# Altium schematic sheet 6_Current_Sensing.SchDoc: DB_ADCS Current Sensing
size A4; DrawnBy: Augusto Cezar Boldori Vassoler; Revision: V2.1; SheetNumber: 7; SheetTotal: 7
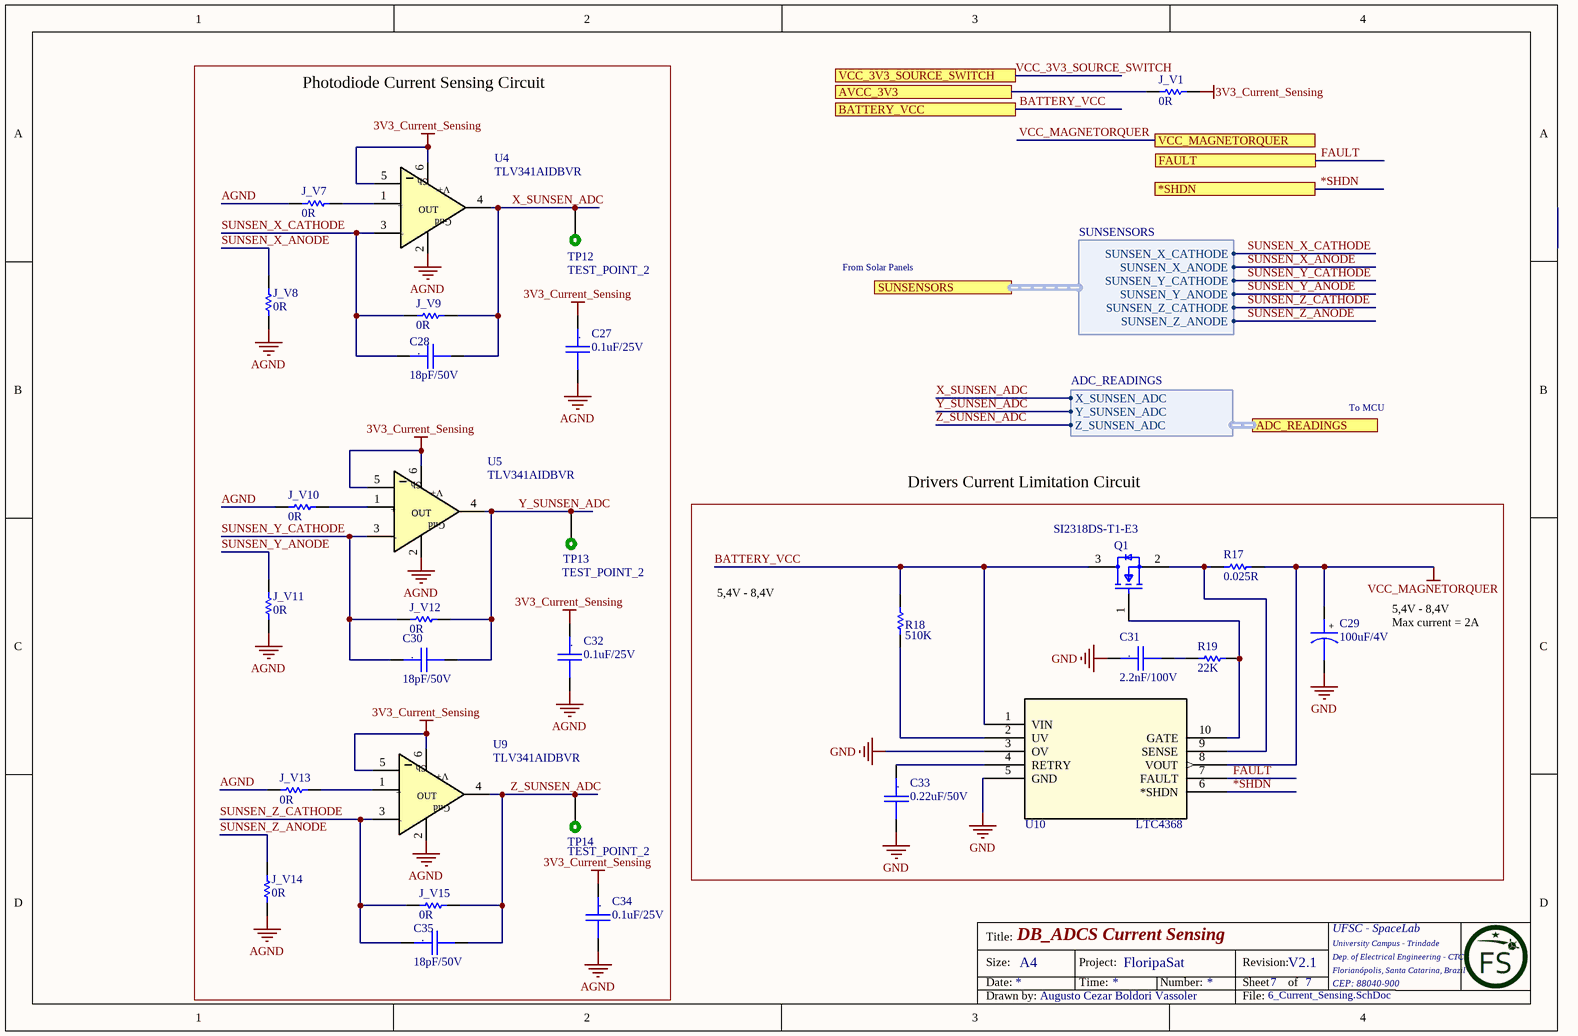
[diagram p0: 6_Current_Sensing.SchDoc]

## Parts
C27  0.1uF/25V  [CC0805]
C28  18pF/50V  [CC0805]
C29  100uF/4V  [CC0805_Tantalum]
C30  18pF/50V  [CC0805]
C31  2.2nF/100V  [CC0805]
C32  0.1uF/25V  [CC0805]
C33  0.22uF/50V  [CC0805]
C34  0.1uF/25V  [CC0805]
C35  18pF/50V  [CC0805]
J_V1  0R  [0805]
J_V7  0R  [0805-LED]
J_V8  0R  [0805-LED]
J_V9  0R  [0805-LED]
J_V10  0R  [0805-LED]
J_V11  0R  [0805-LED]
J_V12  0R  [0805-LED]
J_V13  0R  [0805-LED]
J_V14  0R  [0805-LED]
J_V15  0R  [0805-LED]
Q1  SI2318DS-T1-E3  [FP-S-03946-MFG]
R17  0.025R  [1206]
R18  510K  [0805]
R19  22K  [0805-LED]
TP12  TEST_POINT_2  [TEST_POINT_2]  (no BOM)
TP13  TEST_POINT_2  [TEST_POINT_2]  (no BOM)
TP14  TEST_POINT_2  [TEST_POINT_2]  (no BOM)
U4  TLV341AIDBVR  [SOT-23 6L]
U5  TLV341AIDBVR  [SOT-23 6L]
U9  TLV341AIDBVR  [SOT-23 6L]
U10  LTC4368  [MSOP-10_MS]

## Blocks framed on the sheet
Photodiode Current Sensing Circuit: C27 C28 C30 C32 C34 C35 J_V7-J_V15 TP12-TP14 U4 U5 U9
Drivers Current Limitation Circuit: C29 C31 C33 Q1 R17-R19 U10

## Ports
*SHDN, ADC_READINGS (harness ADC_READINGS), AVCC_3V3, BATTERY_VCC, FAULT, SUNSENSORS (harness SUNSENSORS), VCC_3V3_SOURCE_SWITCH, VCC_MAGNETORQUER

## Harnesses
ADC_READINGS: X_SUNSEN_ADC, Y_SUNSEN_ADC, Z_SUNSEN_ADC
SUNSENSORS: SUNSEN_Z_ANODE, SUNSEN_Z_CATHODE, SUNSEN_Y_ANODE, SUNSEN_Y_CATHODE, SUNSEN_X_ANODE, SUNSEN_X_CATHODE

## Nets
3V3_Current_Sensing: C27.1 C32.1 C34.1 J_V1.1 U4.5(EN) U4.6(V+) U5.5(EN) U5.6(V+) U9.5(EN) U9.6(V+)
AGND: C27.2 C32.2 C34.2 J_V7.2 J_V8.1 J_V10.2 J_V11.2 J_V13.2 J_V14.2 U4.2(Gnd) U5.2(Gnd) U9.2(Gnd)
GND: C29.2 C31.1 C33.2 U10.3(OV) U10.5(GND)
VCC_MAGNETORQUER: C29.1 R17.1 U10.8(VOUT) ; port VCC_MAGNETORQUER
*SHDN: U10.6(*SHDN) ; port *SHDN
AVCC_3V3: J_V1.2 ; port AVCC_3V3
BATTERY_VCC: Q1.3(D) R18.1 U10.1(VIN) ; port BATTERY_VCC
FAULT: U10.7(FAULT) ; port FAULT
SUNSEN_X_ANODE: J_V8.2 ; port SUNSENSORS.SUNSEN_X_ANODE
SUNSEN_X_CATHODE: C28.1 J_V9.2 U4.3(-IN) ; port SUNSENSORS.SUNSEN_X_CATHODE
SUNSEN_Y_ANODE: J_V11.1 ; port SUNSENSORS.SUNSEN_Y_ANODE
SUNSEN_Y_CATHODE: C30.1 J_V12.2 U5.3(-IN) ; port SUNSENSORS.SUNSEN_Y_CATHODE
SUNSEN_Z_ANODE: J_V14.1 ; port SUNSENSORS.SUNSEN_Z_ANODE
SUNSEN_Z_CATHODE: C35.1 J_V15.2 U9.3(-IN) ; port SUNSENSORS.SUNSEN_Z_CATHODE
VCC_3V3_SOURCE_SWITCH: port VCC_3V3_SOURCE_SWITCH
X_SUNSEN_ADC: C28.2 J_V9.1 TP12.1 U4.4(OUT) ; port ADC_READINGS.X_SUNSEN_ADC
Y_SUNSEN_ADC: C30.2 J_V12.1 TP13.1 U5.4(OUT) ; port ADC_READINGS.Y_SUNSEN_ADC
Z_SUNSEN_ADC: C35.2 J_V15.1 TP14.1 U9.4(OUT) ; port ADC_READINGS.Z_SUNSEN_ADC
NetC31_2: C31.2 R19.2
NetC33_1: C33.1 U10.4(RETRY)
NetJ_V7_1: J_V7.1 U4.1(+IN)
NetJ_V10_1: J_V10.1 U5.1(+IN)
NetJ_V13_1: J_V13.1 U9.1(+IN)
NetQ1_1: Q1.1(G) R19.1 U10.10(GATE)
NetQ1_2: Q1.2(S) R17.2 U10.9(SENSE)
NetR18_2: R18.2 U10.2(UV)

## Notes on the sheet
- From Solar Panels
- To MCU
- 5,4V - 8,4V
- 5,4V - 8,4V                                                                                                                     Max current = 2A
- Title:
- Size:
- Date:
- A4
- Project:
- Time:
- FloripaSat
- Number:
- Revision:
- Sheet
- of
- UFSC - SpaceLab
- University Campus - Trindade
- Dep. of Electrical Engineering - CTC
- Florianópolis, Santa Catarina, Brazil
- CEP: 88040-900
- Drawn by:
- File:
- (in symbol Cap_Cer_X7R_0.1uF_25V_0805) .
- (in symbol Cap_Cer_X7R_0.22uF_0805) .
- (in symbol Cap_Cer_X7R_0.0022uF_0805) .
- (in symbol Cap_Cer_X7R_18pF_50V_0805) .
- (in symbol Cap_Tant_SMD_100uF_4V_0805) +
- (in symbol TLV341AIDBVR) Sh; +; -

## Library data of the parts
C27 C32 C34 = Cap_Cer_X7R_0.1uF_25V_0805: CAP CER 0.1UF 25V 10% X7R 0805; Partnumber: CC0805KRX7R8BB104; NCM: 8532.24.10
C28 C30 C35 = Cap_Cer_X7R_18pF_50V_0805: CAP CER 18pF 50V 5% X7R 0805; Partnumber: CC0805JRNPO9BN180; NCM: 8532.24.10
C29 = Cap_Tant_SMD_100uF_4V_0805: CAP TANT 100UF 4V 20% 0805; Manufacturer: Kyocera AVX; Manufacturer Part Number: TACR107M004RTA; Dielectric Material: Tantalum; ESR (Equivalent Series Resistance): 5R; Leakage Current: 4uA; Dissipation Factor: 30%; Polarity: Polar; Supplier 1: Digi-Key; Supplier Part Number 1: 478-4755-1-ND; RoHS: Yes; Category: Tantalum Capacitors; Stock 1: 1150; Pricing 1: 1=3,32000, 10=2,68800, 100=2,05280, 500=1,56400, 1000=1,36850 (USD); Mount: Surface Mount; Case/Package: 0805; Number of Pins: 2; Case Code (Metric): 2012; Case Code (Imperial): 0805; Min Operating Temperature: -55°C; Max Operating Temperature: 125°C; Capacitance: 100uF; Tolerance: 20%; Packaging: Tape and Reel; Voltage Rating: 4V; Features: General Purpose; Voltage Rating (DC): 4V; Package Quantity: 1; Termination: SMD/SMT; Length: 2mm; Height: 1.5mm; Width: 0.053inch; Height - Seated (Max): 0.059inch; Depth: 1.35mm; ComponentLink1URL: https://datasheet.ciiva.com/265/tac-265068.pdf?src-supplier=Digi-Key; ComponentLink1Description: https://datasheet.ciiva.com/265/tac-265068.pdf?src-supplier=Digi-Key; ComponentLink2URL: https://datasheet.ciiva.com/12890/tac-12890332.pdf?src-supplier=Mouser; ComponentLink2Description: https://datasheet.ciiva.com/12890/tac-12890332.pdf?src-supplier=Mouser; ComponentLink3URL: https://datasheet.ciiva.com/265/tac-265066.pdf?src-supplier=Digi-Key; ComponentLink3Description: https://datasheet.ciiva.com/265/tac-265066.pdf?src-supplier=Digi-Key; ComponentLink4URL: https://datasheet.ciiva.com/265/tac-265067.pdf?src-supplier=Digi-Key; ComponentLink4Description: https://datasheet.ciiva.com/265/tac-265067.pdf?src-supplier=Digi-Key; ComponentLink5URL: https://datasheet.ciiva.com/11301/tac-11301084.pdf?src-supplier=Avnet; ComponentLink5Description: https://datasheet.ciiva.com/11301/tac-11301084.pdf?src-supplier=Avnet
C31 = Cap_Cer_X7R_0.0022uF_0805: Cap Cer 0.0022uF 100V X7R 5% 0805; Manufacturer: Kyocera AVX; Manufacturer Part Number: 08051C222JAT2A; Dielectric Material: Ceramic; Capacitance: 2.2nF; Dissipation Factor: 2.5%; Insulation Resistance: 100GR; Supplier 1: Digi-Key; Supplier Part Number 1: 478-3746-1-ND; RoHS: Yes; Category: Ceramic Capacitors; Stock 1: 21530; Pricing 1: 1=0,23000, 10=0,15400, 100=0,07790, 500=0,05328, 1000=0,04713 (USD); Mount: Surface Mount; Case/Package: 0805; Number of Pins: 2; Case Code (Metric): 2012; Case Code (Imperial): 0805; Contact Plating: Tin,Matte; Min Operating Temperature: -55°C; Max Operating Temperature: 125°C; Dielectric: X7R; Tolerance: 5%; Packaging: Tape and Reel; Voltage Rating (DC): 100V; Voltage Rating: 100V; Termination: SMD/SMT; Package Quantity: 1; Voltage: 100V; Length: 2.01mm; Height: 0.94mm; Depth: 1.25mm; Width: 0.049inch; Thickness: 0.037inch; Radiation Hardening: No; REACH SVHC: No SVHC; Lead Free: Lead Free; ComponentLink1URL: https://datasheet.ciiva.com/11536/cx7r-11536917.pdf?src-supplier=Avnet; ComponentLink1Description: https://datasheet.ciiva.com/11536/cx7r-11536917.pdf?src-supplier=Avnet; ComponentLink2URL: https://datasheet.ciiva.com/150/cx7r-150872.pdf?src-supplier=Digi-Key; ComponentLink2Description: https://datasheet.ciiva.com/150/cx7r-150872.pdf?src-supplier=Digi-Key; ComponentLink3URL: https://datasheet.ciiva.com/150/cx7r-150873.pdf?src-supplier=Digi-Key; ComponentLink3Description: https://datasheet.ciiva.com/150/cx7r-150873.pdf?src-supplier=Digi-Key; ComponentLink4URL: https://datasheet.ciiva.com/150/cx7r-150874.pdf?src-supplier=Digi-Key; ComponentLink4Description: https://datasheet.ciiva.com/150/cx7r-150874.pdf?src-supplier=Digi-Key; ComponentLink5URL: https://datasheet.ciiva.com/7811/cx7r-7811933.pdf?src-supplier=Element14; ComponentLink5Description: https://datasheet.ciiva.com/7811/cx7r-7811933.pdf?src-supplier=Element14; ComponentLink6URL: https://datasheet.ciiva.com/7811/cx7r-7811934.pdf?src-supplier=Element14; ComponentLink6Description: https://datasheet.ciiva.com/7811/cx7r-7811934.pdf?src-supplier=Element14; ComponentLink7URL: https://datasheet.ciiva.com/7811/cx7r-7811935.pdf?src-supplier=Element14; ComponentLink7Description: https://datasheet.ciiva.com/7811/cx7r-7811935.pdf?src-supplier=Element14
C33 = Cap_Cer_X7R_0.22uF_0805: CAP CER 0.22UF 50V X7R 0805; Manufacturer: KEMET; Manufacturer Part Number: C0805C224K5RACTU; Dielectric Material: Ceramic; Capacitance: 220nF; Tolerance: 10%; Dissipation Factor: 2.5%; Supplier 1: Digi-Key; Supplier Part Number 1: 399-3491-1-ND; RoHS: Yes; Category: Ceramic Capacitors; Stock 1: 1491563; Pricing 1: 1=0,20000, 10=0,13900, 100=0,06550, 500=0,04592, 1000=0,03802 (USD); Mount: Surface Mount,PCB; Case/Package: 0805; Case Code (Metric): 2012; Case Code (Imperial): 0805; Min Operating Temperature: -55°C; Max Operating Temperature: 125°C; Packaging: Tape and Reel; Dielectric: X7R; Package Quantity: 1; Voltage Rating: 50V; Voltage Rating (DC): 50V; Termination: SMD/SMT; Voltage: 50V; Length: 2mm; Height: 1.1mm; Depth: 1.25mm; Width: 0.049inch; Thickness: 0.055inch; Lead Pitch: 0.75mm; Radiation Hardening: No; REACH SVHC: No SVHC; ComponentLink1URL: https://datasheet.ciiva.com/7842/kem-c1002-x7r-smd-7842582.pdf?src-supplier=Element14; ComponentLink1Description: https://datasheet.ciiva.com/7842/kem-c1002-x7r-smd-7842582.pdf?src-supplier=Element14; ComponentLink2URL: https://datasheet.ciiva.com/18193/getdatasheetpartid-304413-18193686.pdf?src-supplier=Verical; ComponentLink2Description: https://datasheet.ciiva.com/18193/getdatasheetpartid-304413-18193686.pdf?src-supplier=Verical; ComponentLink3URL: https://datasheet.ciiva.com/14589/70095383-14589519.pdf?src-supplier=Allied+Electronics; ComponentLink3Description: https://datasheet.ciiva.com/14589/70095383-14589519.pdf?src-supplier=Allied+Electronics; ComponentLink4URL: https://datasheet.ciiva.com/14603/70095383-14603247.pdf?src-supplier=Allied+Electronics; ComponentLink4Description: https://datasheet.ciiva.com/14603/70095383-14603247.pdf?src-supplier=Allied+Electronics; ComponentLink5URL: https://datasheet.ciiva.com/28682/1851736-28682316.pdf?src-supplier=Element14; ComponentLink5Description: https://datasheet.ciiva.com/28682/1851736-28682316.pdf?src-supplier=Element14
J_V1 J_V7-J_V15 = R0R_JUMPER_1/16W_0805: RES 0R OHM 1/16W JUMPER 0805; Partnumber: CRCW08050000Z0EA; NCM: 8533.21.20
Q1 = CMP-02550-000015-1: MOSFET N-CH 40V 3A SOT23-3; Manufacturer: Vishay; Input Capacitace At Vds: 540pF @ 20V; Turn On Delay Time: 5ns; Standoff Height: 0.01mm; Rthja Max: 120°C/W; Power Dissipation: 0.75W; Number Of Channels: 1; Max Junction Temp: +150°C; Gate Charge At Vgs: 10nC @ 10V; Pulse Drain Current: 16A; Turn Off Delay Time: 20ns; Threshold Vgs Min: 1V; Depletion Mode: False; Max Forward Diode Voltage: 1.2V; Drain To Source Resistance: 0.036Ω; Gate To Source Voltage: 20V; Transconductance: 11S; Threshold Vgs Max: 3V; Typ Forward Diode Voltage: 0.8V; Lead Free: Yes; Temperature Range Low: -55°C; Drain To Source Voltage: 40V; Category: Trans; Number Of N Channels: 1; Temperature Range High: +150°C; RoHS: TRUE; Digikey Description: MOSFET N-CH 40V 3A SOT23-3; Mouser Description: MOSFET 40V 6A; Manufacturer Part Number: SI2318DS-T1-E3; Drain To Source Breakdown Voltage: 40V; ComponentLink2Description: Datasheet; Device Class L1: Discrete Semiconductors; Temperature: -55°C to +150°C; Automotive: No; Package: S-03946; Device Class L3: MOSFETs; Height: 1.12mm; Octopart: https://octopart.com/si2318ds-t1-e3-vishay-40866469; Continuous Drain Current: 3A; Device Class L2: Transistors; ComponentLink2URL: http://www.vishay.com/docs/72322/72322.pdf
R17 = R0.025_1%_1/4W_1206: RES 0.025 OHM - 0.25W 1% 1206; Manufacturer: Vishay Dale; Manufacturer Part Number: WSL1206R0250FBA; Resistance: 25mR; Power Rating: 250mW; Temperature Coefficient: 75ppm/°C; Supplier 1: Avnet; Supplier Part Number 1: WSL1206R0250FBA; RoHS: Yes; Category: Chip SMD Resistors; Pricing 1: 100=0,46579, 200=0,42600, 400=0,30800, 600=0,29920, 800=0,29260 (USD); Case/Package: 1206; Contact Plating: Tin,Lead; Case Code (Imperial): 1206; Case Code (Metric): 3216; Min Operating Temperature: -65°C; Max Operating Temperature: 170°C; Packaging: Bulk; Tolerance: 1%; Composition: Metal Strip; Termination: SMD/SMT; Package Quantity: 100; Length: 3.2mm; Height: 0.635mm; Width: 1.6mm; Radiation Hardening: No; Lead Free: Lead Free; ComponentLink1URL: https://datasheet.ciiva.com/9024/wsl-9024860.pdf?src-supplier=Avnet; ComponentLink1Description: https://datasheet.ciiva.com/9024/wsl-9024860.pdf?src-supplier=Avnet
R18 = R510K_1%_1/8W_0805: RES 510K OHM 1/8W 1% 0805; Manufacturer: Vishay; Manufacturer Part Number: CRCW0805510KFKEA; Resistance: 510kR; Temperature Coefficient: 100ppm/°C; Power Rating: 125mW; Voltage Rating: 150V; Supplier 1: Digi-Key; Supplier Part Number 1: 541-510KCCT-ND; RoHS: Yes; Category: Chip SMD Resistors; Stock 1: 12876; Pricing 1: 1=0,10000, 10=0,06200, 100=0,02540, 1000=0,01142, 2500=0,00991 (USD); Mount: Surface Mount; Case/Package: 0805; Number of Pins: 2; Weight: 0.000194oz; Case Code (Imperial): 0805; Case Code (Metric): 2012; Contact Plating: Tin; Min Operating Temperature: -55°C; Max Operating Temperature: 155°C; Tolerance: 1%; Packaging: Tape and Reel; Composition: Thick Film; Package Quantity: 10; Voltage Rating (DC): 150V; Max Power Dissipation: 125mW; Number of Terminations: 2; Termination: SMD/SMT; Features: Automotive AEC-Q200; Military Standard: Not; Length: 2mm; Height: 0.45mm; Width: 1.25mm; Depth: 1.25mm; Radiation Hardening: No; Lead Free: Lead Free; REACH SVHC: Unknown; ComponentLink1URL: https://datasheet.ciiva.com/11809/0900766b80d98b26-11809600.pdf?src-supplier=RSComponents; ComponentLink1Description: https://datasheet.ciiva.com/11809/0900766b80d98b26-11809600.pdf?src-supplier=RSComponents; ComponentLink2URL: https://datasheet.ciiva.com/7726/dcrcwe3-7726005.pdf?src-supplier=Element14; ComponentLink2Description: https://datasheet.ciiva.com/7726/dcrcwe3-7726005.pdf?src-supplier=Element14; ComponentLink3URL: https://datasheet.ciiva.com/16500/dcrcwe3-16500877.pdf?src-supplier=Future+Electronics; ComponentLink3Description: https://datasheet.ciiva.com/16500/dcrcwe3-16500877.pdf?src-supplier=Future+Electronics; ComponentLink4URL: https://datasheet.ciiva.com/16852/dcrcwe3-16852381.pdf?src-supplier=Avnet+Europe; ComponentLink4Description: https://datasheet.ciiva.com/16852/dcrcwe3-16852381.pdf?src-supplier=Avnet+Europe; ComponentLink5URL: https://datasheet.ciiva.com/2467/dcrcwe3-2467631.pdf?src-supplier=Digi-Key; ComponentLink5Description: https://datasheet.ciiva.com/2467/dcrcwe3-2467631.pdf?src-supplier=Digi-Key; ComponentLink6URL: https://datasheet.ciiva.com/5542/dcrcwe3-109170-5542150.pdf?src-supplier=Mouser; ComponentLink6Description: https://datasheet.ciiva.com/5542/dcrcwe3-109170-5542150.pdf?src-supplier=Mouser; ComponentLink7URL: https://datasheet.ciiva.com/16778/70201119-16778886.pdf?src-supplier=Allied+Electronics; ComponentLink7Description: https://datasheet.ciiva.com/16778/70201119-16778886.pdf?src-supplier=Allied+Electronics; ComponentLink8URL: https://datasheet.ciiva.com/26316/fld-crcw-e3-data-en-26316507.pdf?src-supplier=Distrelec; ComponentLink8Description: https://datasheet.ciiva.com/26316/fld-crcw-e3-data-en-26316507.pdf?src-supplier=Distrelec; ComponentLink9URL: https://datasheet.ciiva.com/2467/dcrcwe3-2467629.pdf?src-supplier=Digi-Key; ComponentLink9Description: https://datasheet.ciiva.com/2467/dcrcwe3-2467629.pdf?src-supplier=Digi-Key; ComponentLink10URL: https://datasheet.ciiva.com/22683/1847332-22683325.pdf?src-supplier=Element14; ComponentLink10Description: https://datasheet.ciiva.com/22683/1847332-22683325.pdf?src-supplier=Element14; ComponentLink11URL: https://datasheet.ciiva.com/2467/dcrcwe3-2467630.pdf?src-supplier=Digi-Key; ComponentLink11Description: https://datasheet.ciiva.com/2467/dcrcwe3-2467630.pdf?src-supplier=Digi-Key; ComponentLink12URL: https://datasheet.ciiva.com/8896/dcrcwe3-8896286.pdf?src-supplier=Avnet; ComponentLink12Description: https://datasheet.ciiva.com/8896/dcrcwe3-8896286.pdf?src-supplier=Avnet
R19 = R22K_1%_1.25W_0805: RES 22K OHM 1.25W 1% 0805; Manufacturer: Vishay; Manufacturer Part Number: CRCW080522K0FKEA; Resistance: 22kR; Power Rating: 125mW; Voltage Rating: 150V; Temperature Coefficient: 100ppm/°C; Supplier 1: Digi-Key; Supplier Part Number 1: 541-22.0KCCT-ND; RoHS: Yes; Category: Chip SMD Resistors; Stock 1: 4249; Pricing 1: 1=0,10000, 10=0,06200, 100=0,02540, 1000=0,01142, 2500=0,00991 (USD); Mount: Surface Mount; Case/Package: 0805; Weight: 0.000194oz; Case Code (Metric): 2012; Case Code (Imperial): 0805; Contact Plating: Tin; Min Operating Temperature: -55°C; Max Operating Temperature: 155°C; Tolerance: 1%; Packaging: Tape and Reel; Composition: Thick Film; Number of Terminations: 2; Termination: SMD/SMT; Military Standard: Not; Package Quantity: 10; Max Power Dissipation: 125mW; Voltage Rating (DC): 150V; Features: Automotive AEC-Q200; Length: 2mm; Height: 0.45mm; Depth: 1.25mm; Width: 0.049inch; Radiation Hardening: No; REACH SVHC: Unknown; Lead Free: Lead Free; ComponentLink1URL: https://datasheet.ciiva.com/7673/1720486-7673152.pdf?src-supplier=Element14; ComponentLink1Description: https://datasheet.ciiva.com/7673/1720486-7673152.pdf?src-supplier=Element14; ComponentLink2URL: https://datasheet.ciiva.com/11808/0900766b80d98b26-11808659.pdf?src-supplier=RSComponents; ComponentLink2Description: https://datasheet.ciiva.com/11808/0900766b80d98b26-11808659.pdf?src-supplier=RSComponents; ComponentLink3URL: https://datasheet.ciiva.com/2514/dcrcwe3-2514289.pdf?src-supplier=Digi-Key; ComponentLink3Description: https://datasheet.ciiva.com/2514/dcrcwe3-2514289.pdf?src-supplier=Digi-Key; ComponentLink4URL: https://datasheet.ciiva.com/2514/dcrcwe3-2514290.pdf?src-supplier=Digi-Key; ComponentLink4Description: https://datasheet.ciiva.com/2514/dcrcwe3-2514290.pdf?src-supplier=Digi-Key; ComponentLink5URL: https://datasheet.ciiva.com/2514/dcrcwe3-2514291.pdf?src-supplier=Digi-Key; ComponentLink5Description: https://datasheet.ciiva.com/2514/dcrcwe3-2514291.pdf?src-supplier=Digi-Key; ComponentLink6URL: https://datasheet.ciiva.com/7672/1697337-7672966.pdf?src-supplier=Element14; ComponentLink6Description: https://datasheet.ciiva.com/7672/1697337-7672966.pdf?src-supplier=Element14; ComponentLink7URL: https://datasheet.ciiva.com/16852/dcrcwe3-16852982.pdf?src-supplier=Avnet+Europe; ComponentLink7Description: https://datasheet.ciiva.com/16852/dcrcwe3-16852982.pdf?src-supplier=Avnet+Europe; ComponentLink8URL: https://datasheet.ciiva.com/5548/dcrcwe3-109170-5548344.pdf?src-supplier=Mouser; ComponentLink8Description: https://datasheet.ciiva.com/5548/dcrcwe3-109170-5548344.pdf?src-supplier=Mouser; ComponentLink9URL: https://datasheet.ciiva.com/26317/fld-crcw-e3-data-en-26317161.pdf?src-supplier=Distrelec; ComponentLink9Description: https://datasheet.ciiva.com/26317/fld-crcw-e3-data-en-26317161.pdf?src-supplier=Distrelec; ComponentLink10URL: https://datasheet.ciiva.com/3258/dcrcwe3-3258332.pdf?src-supplier=Avnet; ComponentLink10Description: https://datasheet.ciiva.com/3258/dcrcwe3-3258332.pdf?src-supplier=Avnet; ComponentLink11URL: https://datasheet.ciiva.com/3258/dcrcwe3-3258333.pdf?src-supplier=Avnet; ComponentLink11Description: https://datasheet.ciiva.com/3258/dcrcwe3-3258333.pdf?src-supplier=Avnet; ComponentLink12URL: https://datasheet.ciiva.com/22676/1847332-22676335.pdf?src-supplier=Element14; ComponentLink12Description: https://datasheet.ciiva.com/22676/1847332-22676335.pdf?src-supplier=Element14
TP12-TP14 = TEST_POINT_2: Test point
U10 = LTC4368: LTC4368 - 100V UV/OV and Reverse Protection Controller with Bidirectional Circuit Breaker; Manufacturer: Analog Devices; Manufacturer Part Number: LTC4368IMS-2#PBF; Supplier 1: Digi-Key; Supplier Part Number 1: LTC4368IMS-2#PBF-ND; Stock 1: 2024; Pricing 1: 1=5,46000, 25=3,13000, 100=2,80800 (USD); Number of Pins: 10; ComponentLink1URL: http://www.linear.com/docs/57622?src-supplier=Digi-Key; ComponentLink1Description: http://www.linear.com/docs/57622?src-supplier=Digi-Key; ComponentLink2URL: http://datasheet.octopart.com/LTC4368IMS-2%23PBF-Linear-Technology-datasheet-78375103.pdf?src-supplier=Newark; ComponentLink2Description: http://datasheet.octopart.com/LTC4368IMS-2%23PBF-Linear-Technology-datasheet-78375103.pdf?src-supplier=Newark; ComponentLink3URL: http://sigma.octopart.com/57693147/technical_drawing/Linear-Technology-LTC4368IMS-2%23PBF.pdf?src-supplier=Linear+Technology; ComponentLink3Description: http://sigma.octopart.com/57693147/technical_drawing/Linear-Technology-LTC4368IMS-2%23PBF.pdf?src-supplier=Linear+Technology
U4 U5 U9 = TLV341AIDBVR: Partnumber: TLV341AIDBVR